# EAGLE schematic PIC Uhrfinal (EAGLE 7.5.0)
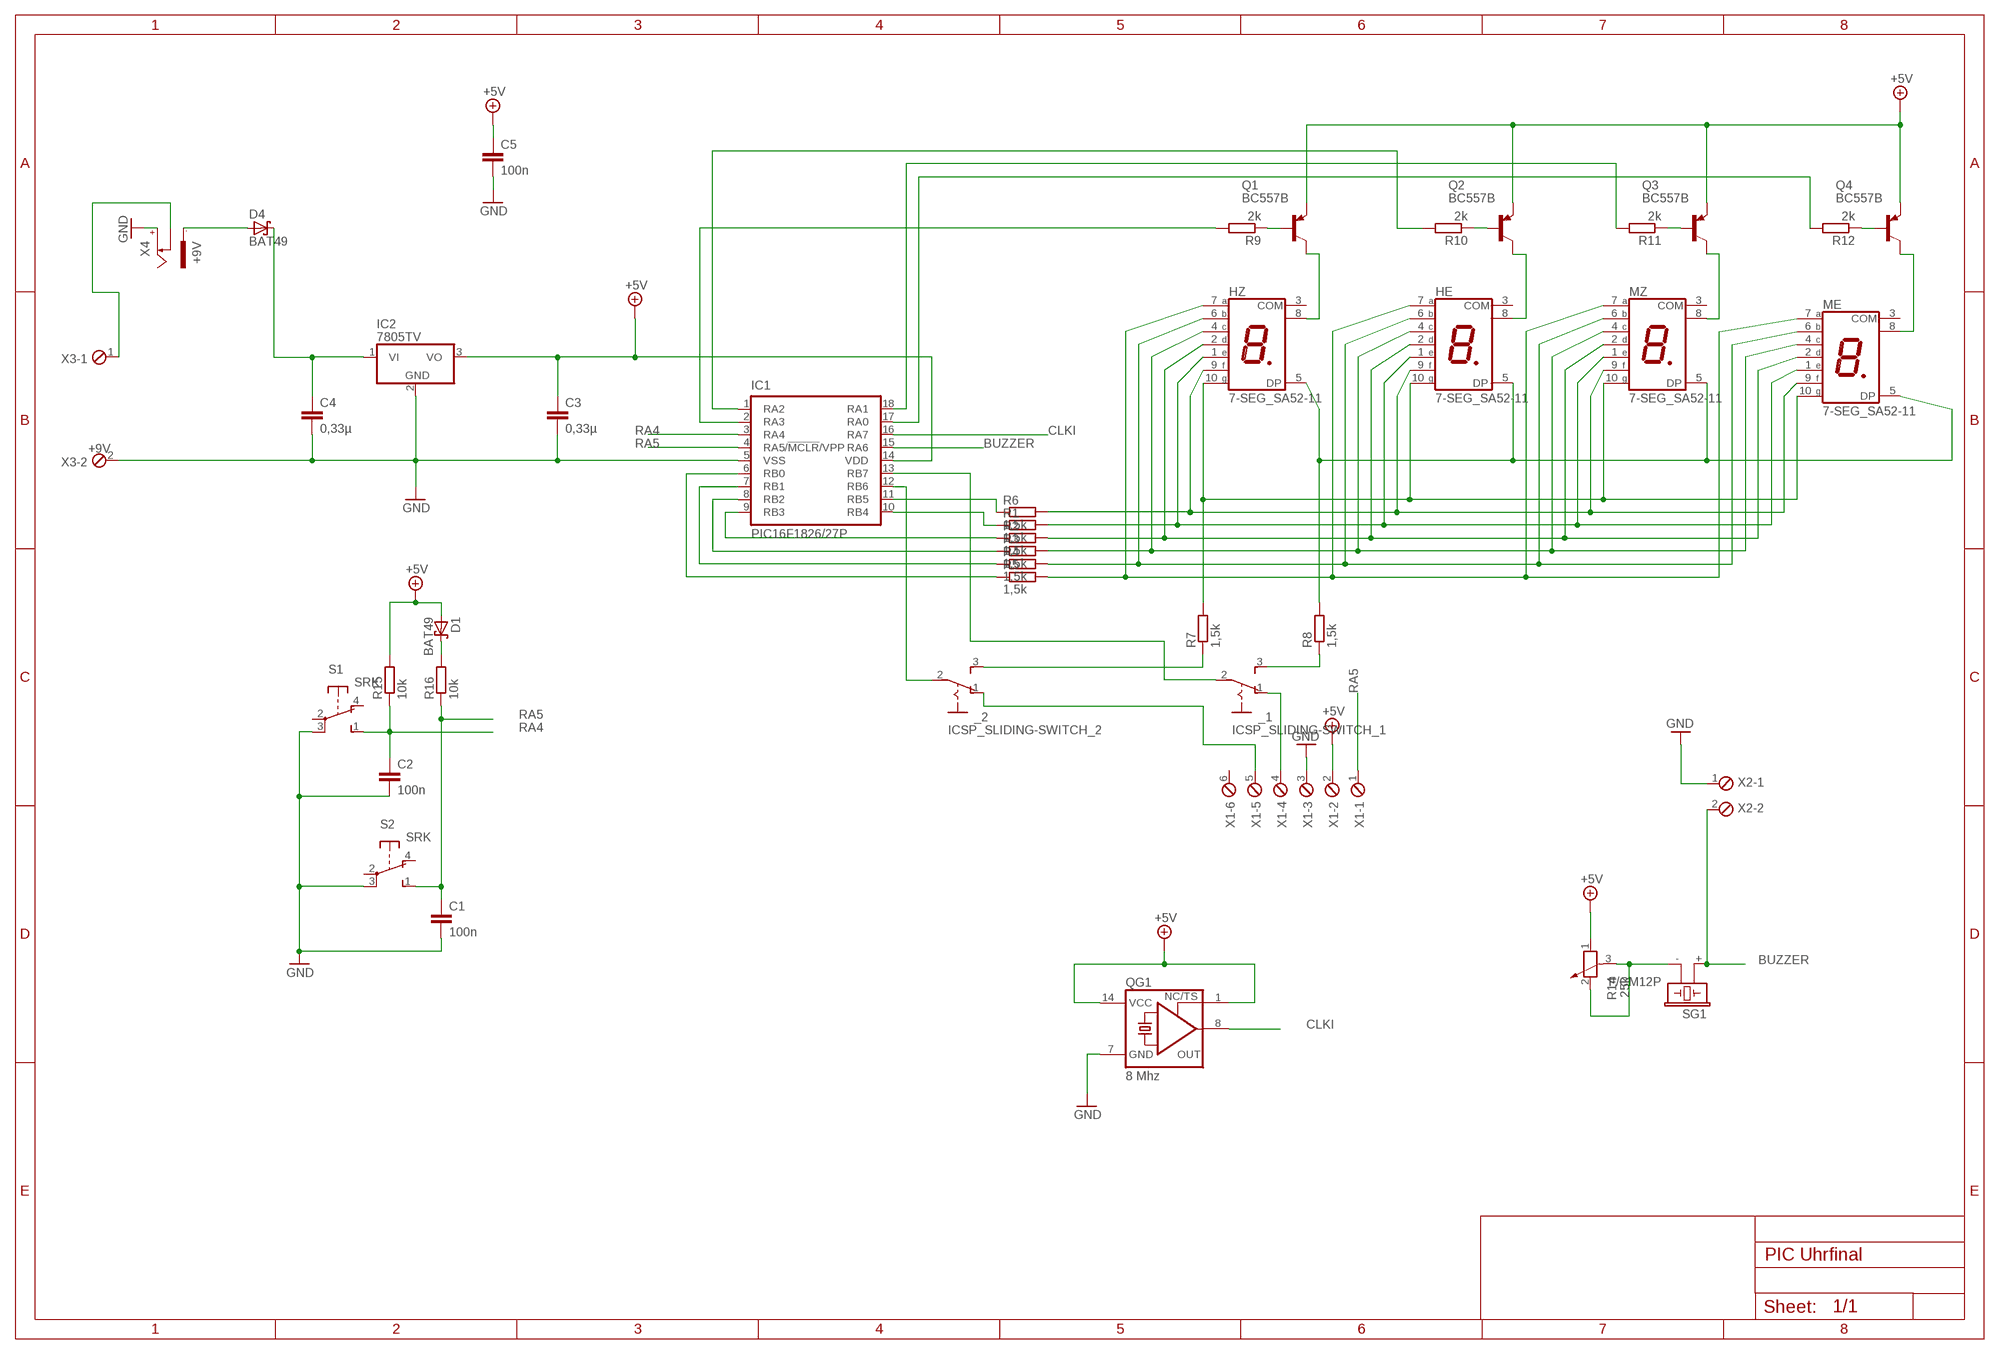
[diagram p0: schematic, sheet 1]

## Parts
C1  100n  C-EUC1206  [C1206]
C2  100n  C-EUC1206  [C1206]
C3  0,33µ  C-EUC1206  [C1206]
C4  0,33µ  C-EUC1206  [C1206]
C5  100n  C-EUC1206  [C1206]
D1  BAT49  [DO41-10]
D4  BAT49  [DO41-10]
HE  7-SEG_SA52-11  [SA52-11]
HZ  7-SEG_SA52-11  [SA52-11]
IC1  PIC16F1826/27P  [DIL18]
IC2  7805TV  [TO220V]
ICSP_SLIDING-SWITCH_1  _1  M251  [M251]
ICSP_SLIDING-SWITCH_2  _2  M251  [M251]
ME  7-SEG_SA52-11  [SA52-11]
MZ  7-SEG_SA52-11  [SA52-11]
Q1  BC557B  [TO92-EBC]
Q2  BC557B  [TO92-EBC]
Q3  BC557B  [TO92-EBC]
Q4  BC557B  [TO92-EBC]
QG1  8 Mhz  XO-14  [DIL14S]
R1  1,5k  R-EU_R0805W  [R0805W]
R2  1,5k  R-EU_R0805W  [R0805W]
R3  1,5k  R-EU_R0805W  [R0805W]
R4  1,5k  R-EU_R0805W  [R0805W]
R5  1,5k  R-EU_R0805W  [R0805W]
R6  1,5k  R-EU_R0805W  [R0805W]
R7  1,5k  R-EU_R0805W  [R0805W]
R8  1,5k  R-EU_R0805W  [R0805W]
R9  2k  R-EU_R0805W  [R0805W]
R10  2k  R-EU_R0805W  [R0805W]
R11  2k  R-EU_R0805W  [R0805W]
R12  2k  R-EU_R0805W  [R0805W]
R14  25k  POTENTIOMETER_PT-10  [PT-10]
R15  10k  R-EU_R1206  [R1206]
R16  10k  R-EU_R1206  [R1206]
S1  SRK  [SRK]
S2  SRK  [SRK]
SG1  F/CM12P  [F/CM12P]
X1  MPT6  [6POL254]
X2  MPT2  [2POL254]
X3  +9V  MPT2  [2POL254]
X4  +9V  737992-55  [737992-5]

## Nets
+5V: C3.1 C5.1 D1.A IC1.14(VDD) IC2.3(VO) Q1.E Q2.E Q3.E Q4.E QG1.1(TS) QG1.14(VCC) R14.1 R15.2 X1.2
BUZZER: IC1.15(RA6) SG1.+ X2.2
CLKI: IC1.16(RA7) QG1.8(OUT)
GND: C1.2 C2.2 C3.2 C4.2 C5.2 IC1.5(VSS) IC2.2(GND) QG1.7(GND) S1.3(P) S2.3(P) X1.3 X2.1 X3.2 X4.+
N$1: HZ.8(COM) Q1.C
N$2: Q1.B R9.1
N$3: Q2.B R10.1
N$4: Q3.B R11.1
N$5: HE.8(COM) Q2.C
N$6: MZ.8(COM) Q3.C
N$7: ME.8(COM) Q4.C
N$8: IC1.2(RA3) R9.2
N$9: IC1.1(RA2) R10.2
N$10: HE.10(G) HZ.10(G) ME.10(G) MZ.10(G) R7.2
N$11: IC1.18(RA1) R11.2
N$12: IC1.17(RA0) R12.2
N$13: Q4.B R12.1
N$14: HE.5(DP) HZ.5(DP) ME.5(DP) MZ.5(DP) R8.2
N$15: HE.9(F) HZ.9(F) ME.9(F) MZ.9(F) R6.2
N$16: HE.7(A) HZ.7(A) ME.7(A) MZ.7(A) R5.2
N$17: C4.1 D4.C IC2.1(VI)
N$18: D4.A X4.-1
N$19: HE.1(E) HZ.1(E) ME.1(E) MZ.1(E) R1.2
N$20: IC1.11(RB5) R6.1
N$21: IC1.10(RB4) R1.1
N$22: IC1.9(RB3) R2.1
N$23: HE.2(D) HZ.2(D) ME.2(D) MZ.2(D) R2.2
N$24: HE.4(C) HZ.4(C) ME.4(C) MZ.4(C) R3.2
N$26: IC1.8(RB2) R3.1
N$27: IC1.7(RB1) R4.1
N$28: IC1.6(RB0) R5.1
N$30: ICSP_SLIDING-SWITCH_2.3(S) R7.1
N$31: IC1.13(RB7) ICSP_SLIDING-SWITCH_1.2(P)
N$32: IC1.12(RB6) ICSP_SLIDING-SWITCH_2.2(P)
N$33: ICSP_SLIDING-SWITCH_1.3(S) R8.1
N$35: ICSP_SLIDING-SWITCH_1.1(O) X1.4
N$36: ICSP_SLIDING-SWITCH_2.1(O) X1.5
N$37: R14.2 R14.3 SG1.-
N$39: X3.1 X4.K
N$40: D1.C R16.2
N$41: HE.6(B) HZ.6(B) ME.6(B) MZ.6(B) R4.2
RA4: C2.1 IC1.3(RA4) R15.1 S1.1(S)
RA5: C1.1 IC1.4(RA5/!MCLR!/VPP) R16.1 S2.1(S) X1.1
Unconnected: HE.3(COM) HZ.3(COM) ME.3(COM) MZ.3(COM) S1.2(P) S1.4(O) S2.2(P) S2.4(O) X1.6 X4.-2

## Library data of the parts
C1-C5 = rcl:C-EU: CAPACITOR, European symbol
D1 D4 = diode:BAT49: DIODE small signal diode
HE HZ ME MZ = display-kingbright:7-SEG_: Kingbright 14.2mm (0.56 INCH) SINGLE DIGIT NUMERIC DUISPLAY Source: SA56-11EWA(Ver1189471036.pdf; OC_FARNELL: unknown; OC_NEWARK: unknown
IC1 = microchip:PIC16*F1826/27: 18/20/28-Pin Flash Microcontrollers with nanoWatt XLP Technology Source: www.microchip.com PIC16F1827.pdf
IC2 = linear:78*: Positive VOLTAGE REGULATOR Source: http://cache.national.com/ds/LM/LM78L05.pdf http://www.fairchildsemi.com/ds/LM/LM7805.pdf
ICSP_SLIDING-SWITCH_1 ICSP_SLIDING-SWITCH_2 = switch:M251: SLIDING SWITCH Mors, distributor Buerklin, 11G702
Q1-Q4 = transistor-pnp:BC557*: PNP Transistror
QG1 = crystal:XO-: CRYSTAL; OC_FARNELL: unknown; OC_NEWARK: unknown
R1-R12 R15 R16 = rcl:R-EU_: RESISTOR, European symbol
R14 = rcl:POTENTIOMETER_: Potentiometer
S1 S2 = switch-misc:SRK: SWITCH
SG1 = buzzer:F/CM12P: BUZZER Source: Buerklin; OC_FARNELL: unknown; OC_NEWARK: unknown
X1 = con-phoenix-254:MPT6: PHOENIX CONNECTOR; OC_FARNELL: unknown; OC_NEWARK: unknown
X2 X3 = con-phoenix-254:MPT2: PHOENIX CONNECTOR; OC_FARNELL: unknown; OC_NEWARK: unknown
X4 = con-conrad:737992-55: FEMALE PRINT CONNECTOR DIN 45323 (34V/3A), ROKA, distributor Conrad